# Altium schematic sheet DC-DC_MC34063.SchDoc
size A4; SheetNumber: 2; SheetTotal: 6
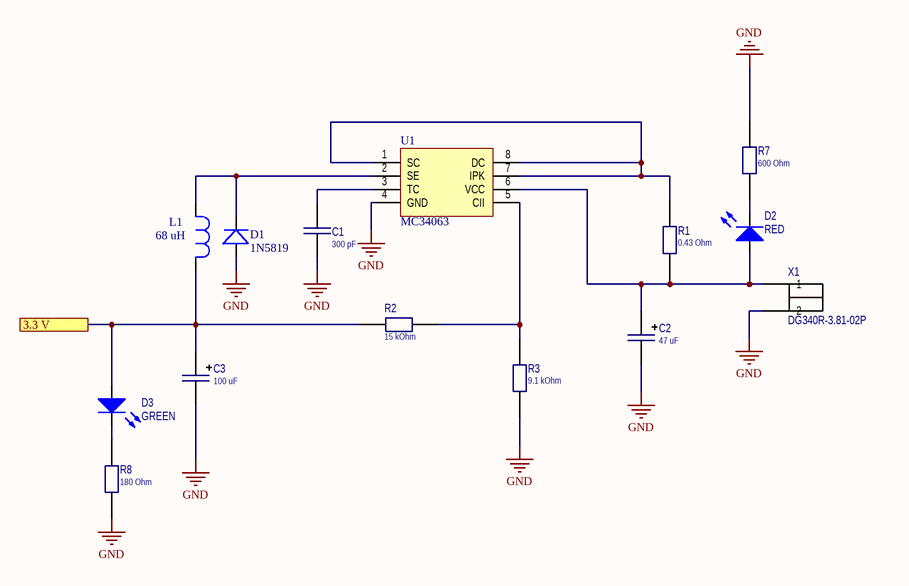
[diagram p0: DC-DC_MC34063.SchDoc]

## Parts
C1  300 pF  [C_0805]
C2  47 uF  [Cap 0810 F]
C3  100 uF  [Cap 0810 F]
D1  1N5819  [DO-41]
D2  RED  [LED_1206]
D3  GREEN  [LED_1206]
L1  68 uH  [L_1210]
R1  0.43 Ohm  [R_0805]
R2  15 kOhm  [R_0805]
R3  9.1 kOhm  [R_0805]
R7  600 Ohm  [R_0805]
R8  180 Ohm  [R_0805]
U1  MC34063  [SO-8]
X1  DG340R-3.81-02P  [340-021-12]

## Ports
3.3 V (see MainSheet[2C], BME280[2B], DS18B20[2C], STM32F103C8T6[1C], TH02[1B])

## Nets
GND: C1.1 C2.1 C3.1 D1.1(A) R3.1 R7.2 R8.1 U1.4(GND) X1.2
3.3 V: C3.2 D3.1(A) L1.2 R2.1 ; port 3.3 V
NetC1_2: C1.2 U1.3(TC)
NetC2_2: C2.2 D2.1(A) R1.1 U1.6(VCC) X1.1
NetD1_2: D1.2(K) L1.1 U1.2(SE)
NetD2_2: D2.2(K) R7.1
NetD3_2: D3.2(K) R8.2
NetR1_2: R1.2 U1.1(SC) U1.7(IPK) U1.8(DC)
NetR2_2: R2.2 R3.2 U1.5(CII)

## Library data of the parts
C1 = C0805: Capacitor; Value: 300 pF
C2 C3 = CAP0810Alu: Capacitor
  C2: Value: 47 uF
  C3: Value: 100 uF
D2 D3 = LED_SMT_1206: Typical INFRARED GaAs LED; Value: *; Color: *
L1 = L1210: Inductor; Part Number: NLCV32T-680K-EF
R1-R3 R7 R8 = R0805: Resistor
  R1: Value: 0.43 Ohm
  R2: Value: 15 kOhm
  R3: Value: 9.1 kOhm
  R7: Value: 600 Ohm
  R8: Value: 180 Ohm
X1 = DG340R-3.81-02P: Connectors; Type: DG340R-3.81-02P